# EAGLE design schemat1 (EAGLE 9.1.0)
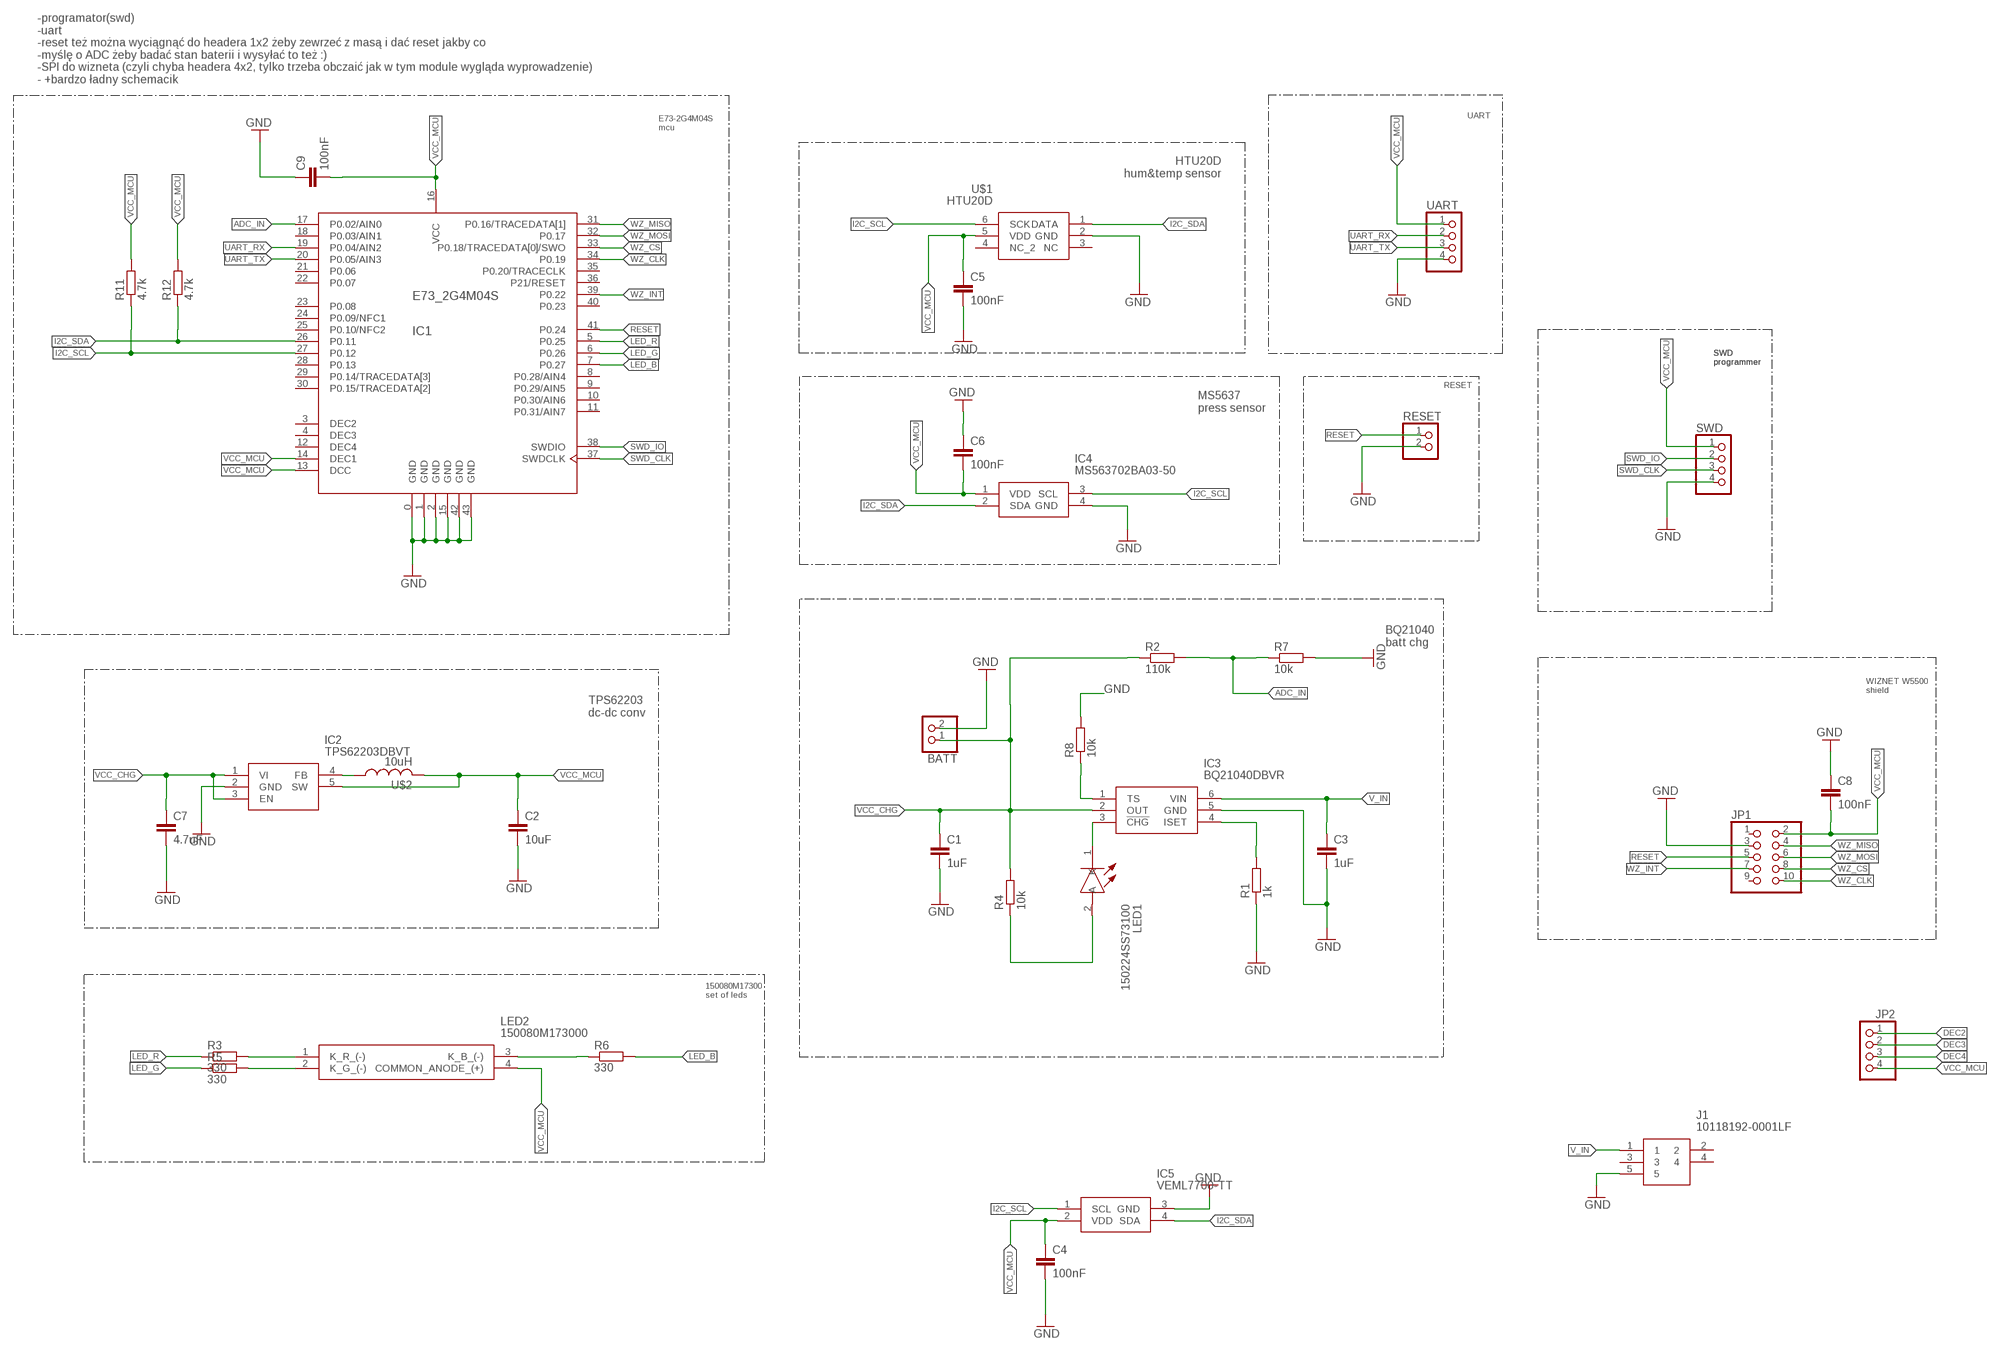
[diagram p0: schematic, sheet 1]

## Parts
BATT  PINHD-1X2  [1X02]
C1  1uF  C-EUC0603K  [C0603K]
C2  10uF  C-EUC0603K  [C0603K]
C3  1uF  C-EUC0603K  [C0603K]
C4  100nF  C-EUC0603K  [C0603K]
C5  100nF  C-EUC0603K  [C0603K]
C6  100nF  C-EUC0603K  [C0603K]
C7  4.7uF  C-EUC0603K  [C0603K]
C8  100nF  C-EUC0603K  [C0603K]
C9  100nF  C-EUC0603K  [C0603K]
IC1  E73_2G4M04S  [E73_2G4M04S]
IC2  TPS62203DBVT  [SOT95P280X145-5N]
IC3  BQ21040DBVR  [SOT95P280X145-6N]
IC4  MS563702BA03-50  [MS5637_1]
IC5  VEML7700-TT  [VEML7700]
J1  10118192-0001LF  [10118192-0001LF]
JP1  PINHD-2X5  [2X05]
JP2  PINHD-1X4  [1X04]
LED1  150224SS73100  [LEDM2314X131N]
LED2  150080M173000  [150080M173000]
R1  1k  R-EU_R0603  [R0603]
R2  110k  R-EU_R0603  [R0603]
R3  330  R-EU_R0603  [R0603]
R4  10k  R-EU_R0603  [R0603]
R5  330  R-EU_R0603  [R0603]
R6  330  R-EU_R0603  [R0603]
R7  10k  R-EU_R0603  [R0603]
R8  10k  R-EU_R0603  [R0603]
R11  4.7k  R-EU_R0603  [R0603]
R12  4.7k  R-EU_R0603  [R0603]
RESET  PINHD-1X2  [1X02]
SWD  PINHD-1X4  [1X04]
U$1  HTU20D  [SON100P300X300X113-7N]
U$2  10uH  LQG18DEV  [FB_BLM18PG121SN1D]
UART  PINHD-1X4  [1X04]

## Nets
ADC_IN: IC1.17(P0.02/AIN0) R2.2 R7.1
DEC2: JP2.1
DEC3: JP2.2
DEC4: JP2.3
GND: BATT.2 C1.2 C2.2 C3.2 C4.2 C5.2 C6.1 C7.2 C8.1 C9.1 IC1.0(GND) IC1.1(GND) IC1.2(GND) IC1.15(GND) IC1.42(GND) IC1.43(GND) IC2.2(GND) IC3.5(GND) IC4.4(GND) IC5.3(GND) J1.5 JP1.3 R1.1 R7.2 R8.2 RESET.2 SWD.4 U$1.2(GND) UART.4
I2C_SCL: IC1.27(P0.12) IC4.3(SCL) IC5.1(SCL) R11.1 U$1.6(SCK)
I2C_SDA: IC1.26(P0.11) IC4.2(SDA) IC5.4(SDA) R12.1 U$1.1(DATA)
LED_B: IC1.7(P0.27) R6.2
LED_G: IC1.6(P0.26) R5.1
LED_R: IC1.5(P0.25) R3.1
N$1: IC3.3(!CHG) LED1.1(K)
N$2: IC2.4(FB) U$2.1
N$3: LED1.2(A) R4.1
N$4: LED2.3(K_B_(-)) R6.1
N$5: IC3.4(ISET) R1.2
N$6: LED2.2(K_G_(-)) R5.2
N$7: LED2.1(K_R_(-)) R3.2
N$8: IC3.1(TS) R8.1
RESET: IC1.41(P0.24) JP1.5 RESET.1
SWD_CLK: IC1.37(SWDCLK) SWD.3
SWD_IO: IC1.38(SWDIO) SWD.2
UART_RX: IC1.19(P0.04/AIN2) UART.2
UART_TX: IC1.20(P0.05/AIN3) UART.3
V_IN: C3.1 IC3.6(VIN) J1.1
VCC_CHG: BATT.1 C1.1 C7.1 IC2.1(VI) IC2.3(EN) IC3.2(OUT) R2.1 R4.2
VCC_MCU: C2.1 C4.1 C5.1 C6.2 C8.2 C9.2 IC1.13(DCC) IC1.14(DEC1) IC1.16(VCC) IC2.5(SW) IC4.1(VDD) IC5.2(VDD) JP1.2 JP2.4 LED2.4(COMMON_ANODE_(+)) R11.2 R12.2 SWD.1 U$1.5(VDD) U$2.2 UART.1
WZ_CLK: IC1.34(P0.19) JP1.10
WZ_CS: IC1.33(P0.18/TRACEDATA[0]/SWO) JP1.8
WZ_INT: IC1.39(P0.22) JP1.7
WZ_MISO: IC1.31(P0.16/TRACEDATA[1]) JP1.4
WZ_MOSI: IC1.32(P0.17) JP1.6
Unconnected: IC1.8(P0.28/AIN4) IC1.9(P0.29/AIN5) IC1.10(P0.30/AIN6) IC1.11(P0.31/AIN7) IC1.18(P0.03/AIN1) IC1.21(P0.06) IC1.22(P0.07) IC1.23(P0.08) IC1.24(P0.09/NFC1) IC1.25(P0.10/NFC2) IC1.28(P0.13) IC1.29(P0.14/TRACEDATA[3]) IC1.30(P0.15/TRACEDATA[2]) IC1.35(P0.20/TRACECLK) IC1.36(P21/RESET) IC1.40(P0.23) J1.2 J1.3 J1.4 JP1.1 JP1.9 U$1.3(NC) U$1.4(NC_2)

## Notes on the sheet
- -programator(swd)
  -uart
  -reset też można wyciągnąć do headera 1x2 żeby zewrzeć z masą i dać reset jakby co
  -myślę o ADC żeby badać stan baterii i wysyłać to też :) 
  -SPI do wizneta (czyli chyba headera 4x2, tylko trzeba obczaić jak w tym module wygląda wyprowadzenie)
  - +bardzo ładny schemacik
- UART
- E73-2G4M04S
  mcu
- HTU20D
  hum&temp sensor
- SWD
  programmer
- SWD
  programmer
- RESET
- MS5637
  press sensor
- BQ21040
  batt chg
- WIZNET W5500
  shield
- TPS62203
  dc-dc conv
- 150080M17300
  set of leds

## Power pins joined to a net without a drawn wire
DEC2: IC1.3(DEC2)
DEC3: IC1.4(DEC3)
DEC4: IC1.12(DEC4)

## Library data of the parts
BATT RESET = pinhead:PINHD-1X2: PIN HEADER
C1-C9 = rcl:C-EU: CAPACITOR, European symbol; SPICEPREFIX: C
IC1 = E73-2G4M04S:E73_2G4M04S: E73-2G4M04S nRF52832 based BLE module
IC2 = TPS62203DBVT:TPS62203DBVT: 3.3-V Output, 300-mA, 95% Efficient Step-Down Converter in SOT-23 Source: Datasheet <http://www.ti.com/lit/gpn/tps62203>; DESCRIPTION: 3.3-V Output, 300-mA, 95% Efficient Step-Down Converter in SOT-23; HEIGHT: mm; MANUFACTURER_NAME: Texas Instruments; MANUFACTURER_PART_NUMBER: TPS62203DBVT; MOUSER_PART_NUMBER: 595-TPS62203DBVT; MOUSER_PRICE-STOCK: https://www.mouser.com/Search/Refine.aspx?Keyword=595-TPS62203DBVT; RS_PART_NUMBER: 6616976P; RS_PRICE-STOCK: http://uk.rs-online.com/web/p/products/6616976P
IC3 = BQ21040DBVR:BQ21040DBVR: 0.8A Single Input Single-Cell Li-Ion and Li-Pol Battery Charger Source: Datasheet <http://www.ti.com/lit/gpn/bq21040>; DESCRIPTION: 0.8A Single Input Single-Cell Li-Ion and Li-Pol Battery Charger; HEIGHT: 1.45mm; MANUFACTURER_NAME: Texas Instruments; MANUFACTURER_PART_NUMBER: BQ21040DBVR; MOUSER_PART_NUMBER: 595-BQ21040DBVR; MOUSER_PRICE-STOCK: https://www.mouser.com/Search/Refine.aspx?Keyword=595-BQ21040DBVR
IC4 = MS563702BA03-50:MS563702BA03-50: Sensor Pressure 2bar Barometric SMD MS563702BA03-50, Barometric Pressure Sensor, 1200mbar 0 ??? 3.6 V Output, 4-Pin QFN Source: Datasheet <http://docs-emea.rs-online.com/webdocs/142c/0900766b8142cddb.pdf>; DESCRIPTION: Sensor Pressure 2bar Barometric SMD MS563702BA03-50, Barometric Pressure Sensor, 1200mbar 0 ??? 3.6 V Output, 4-Pin QFN; HEIGHT: mm; MANUFACTURER_NAME: TE Connectivity; MANUFACTURER_PART_NUMBER: MS563702BA03-50; MOUSER_PART_NUMBER: 824-MS563702BA03-50; MOUSER_PRICE-STOCK: https://www.mouser.com/Search/Refine.aspx?Keyword=824-MS563702BA03-50; RS_PART_NUMBER: 1704370; RS_PRICE-STOCK: http://uk.rs-online.com/web/p/products/1704370
IC5 = VEML7700-TT:VEML7700-TT: 16Bit Ambient Light Sensor I2C 6.8x2.3mm Source: Datasheet <https://www.arrow.com/en/products/veml7700-tt/vishay>; DESCRIPTION: 16Bit Ambient Light Sensor I2C 6.8x2.3mm; HEIGHT: mm; MANUFACTURER_NAME: Vishay; MANUFACTURER_PART_NUMBER: VEML7700-TT; MOUSER_PART_NUMBER: 78-VEML7700-TT; MOUSER_PRICE-STOCK: https://www.mouser.com/Search/Refine.aspx?Keyword=78-VEML7700-TT; RS_PART_NUMBER: 1226791P; RS_PRICE-STOCK: http://uk.rs-online.com/web/p/products/1226791P
J1 = 10118192-0001LF:10118192-0001LF: FCI,10118192-0001LF,Connector,USB FCI Right Angle Surface Mount Mount Female USB Connector, 100 V ac, 1.8A Source: Datasheet <http://docs-emea.rs-online.com/webdocs/1450/0900766b814507ee.pdf>; ALLIED_NUMBER: 70236826; ALLIED_PRICE-STOCK: http://www.alliedelec.com/fci-10118192-0001lf/70236826/; DESCRIPTION: FCI,10118192-0001LF,Connector,USB FCI Right Angle Surface Mount Mount Female USB Connector, 100 V ac, 1.8A; HEIGHT: mm; MANUFACTURER_NAME: FCI; MANUFACTURER_PART_NUMBER: 10118192-0001LF; MOUSER_PART_NUMBER: 649-10118192-0001LF; MOUSER_PRICE-STOCK: https://www.mouser.com/Search/Refine.aspx?Keyword=649-10118192-0001LF; RS_PART_NUMBER: 8632986; RS_PRICE-STOCK: http://uk.rs-online.com/web/p/products/8632986
JP1 = pinhead:PINHD-2X5: PIN HEADER
JP2 SWD UART = pinhead:PINHD-1X4: PIN HEADER
LED1 = 150224SS73100:150224SS73100: WURTH ELEKTRONIK - 150224SS73100 - LED, RED, 130MCD, 636NM, 2214 Source: Datasheet <http://www.farnell.com/datasheets/2301711.pdf>; DESCRIPTION: WURTH ELEKTRONIK - 150224SS73100 - LED, RED, 130MCD, 636NM, 2214; HEIGHT: 1.31mm; MANUFACTURER_NAME: Wurth Elektronik; MANUFACTURER_PART_NUMBER: 150224SS73100; MOUSER_PART_NUMBER: 710-150224SS73100; MOUSER_PRICE-STOCK: https://www.mouser.com/Search/Refine.aspx?Keyword=710-150224SS73100; RS_PART_NUMBER: 1766090; RS_PRICE-STOCK: http://uk.rs-online.com/web/p/products/1766090
LED2 = 150080M173000:150080M173000: Wurth Elektronik 150080M173000, WL-SFCW 470 (Blue) nm, 525 (Green) nm, 624 (Red) nm 3 RGB LED, 4-Pin 0805 Clear Source: Datasheet <http://uk.rs-online.com/web/p/products/1766236>; DESCRIPTION: Wurth Elektronik 150080M173000, WL-SFCW 470 (Blue) nm, 525 (Green) nm, 624 (Red) nm 3 RGB LED, 4-Pin 0805 Clear; HEIGHT: 0.5mm; MANUFACTURER_NAME: Wurth Elektronik; MANUFACTURER_PART_NUMBER: 150080M173000; MOUSER_PART_NUMBER: 710-150080M173000; MOUSER_PRICE-STOCK: https://www.mouser.com/Search/Refine.aspx?Keyword=710-150080M173000; RS_PART_NUMBER: 1766236; RS_PRICE-STOCK: http://uk.rs-online.com/web/p/products/1766236
R1-R8 R11 R12 = rcl:R-EU_: RESISTOR, European symbol; SPICEPREFIX: R
U$1 = SON100P300X300X113-7N:HTU20D
U$2 = LQG18HN12NJ00D:LQG18DEV

## Board
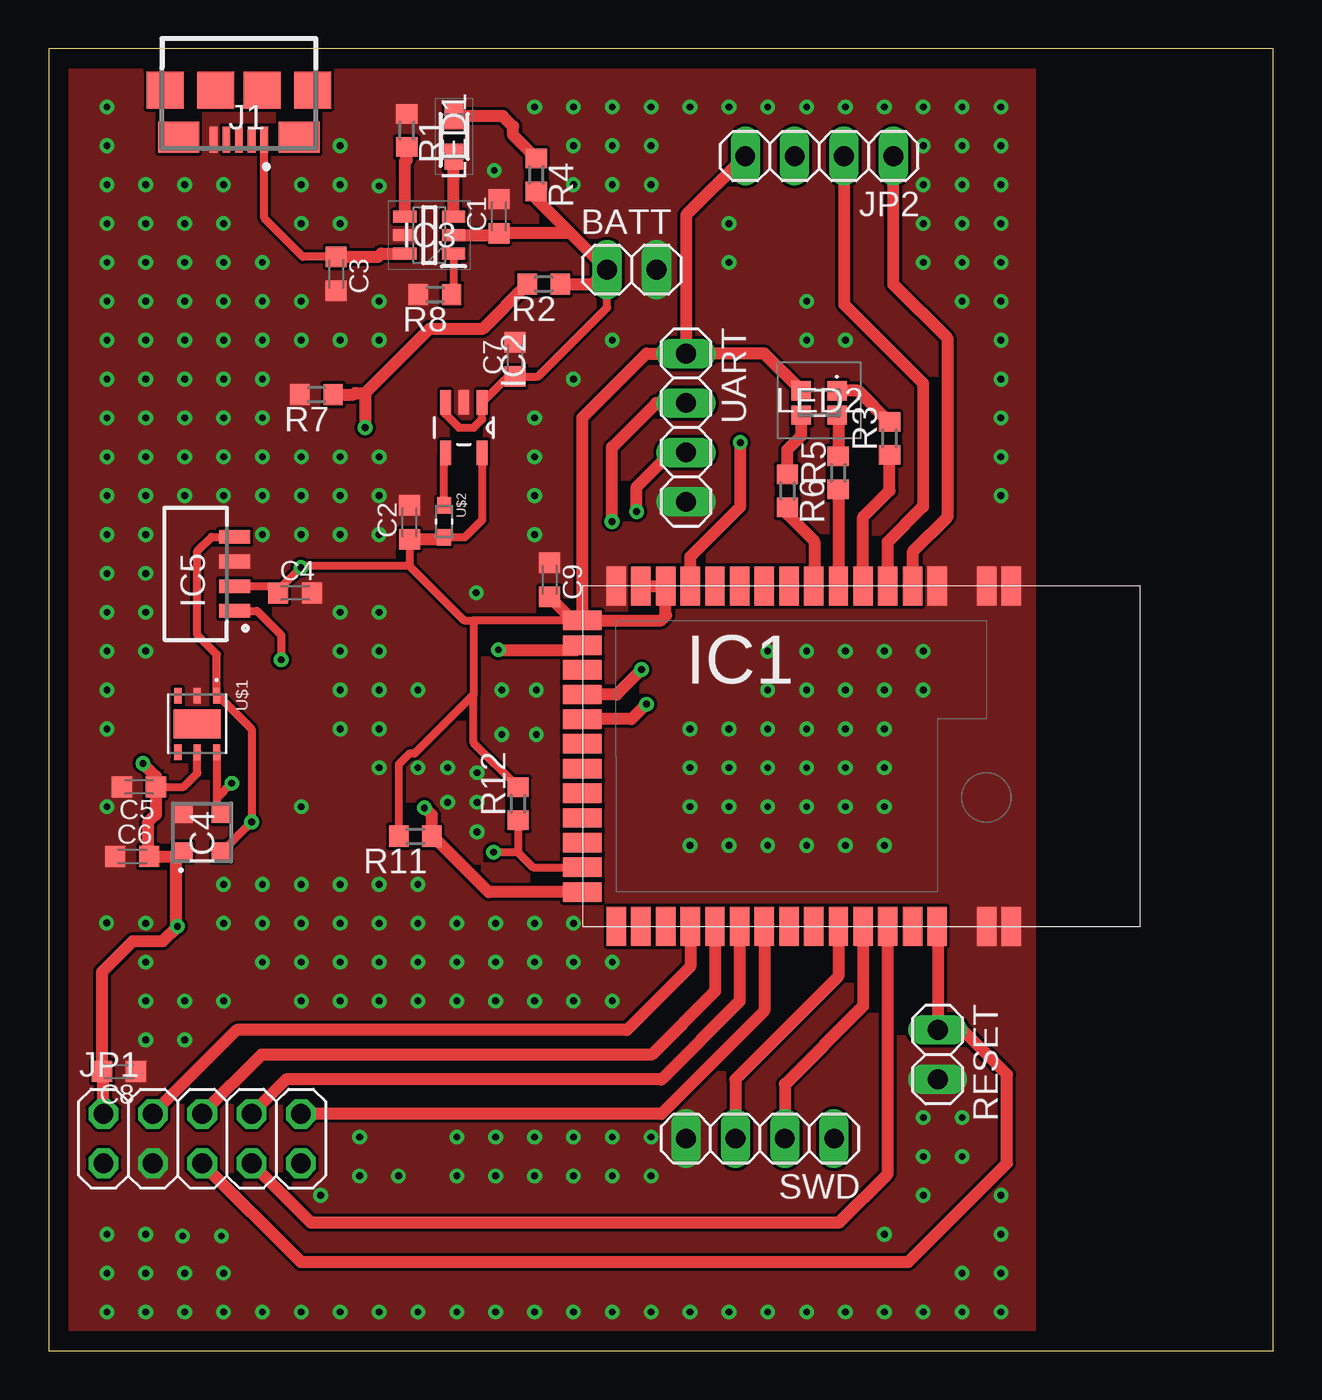
[diagram p1: board, top side]
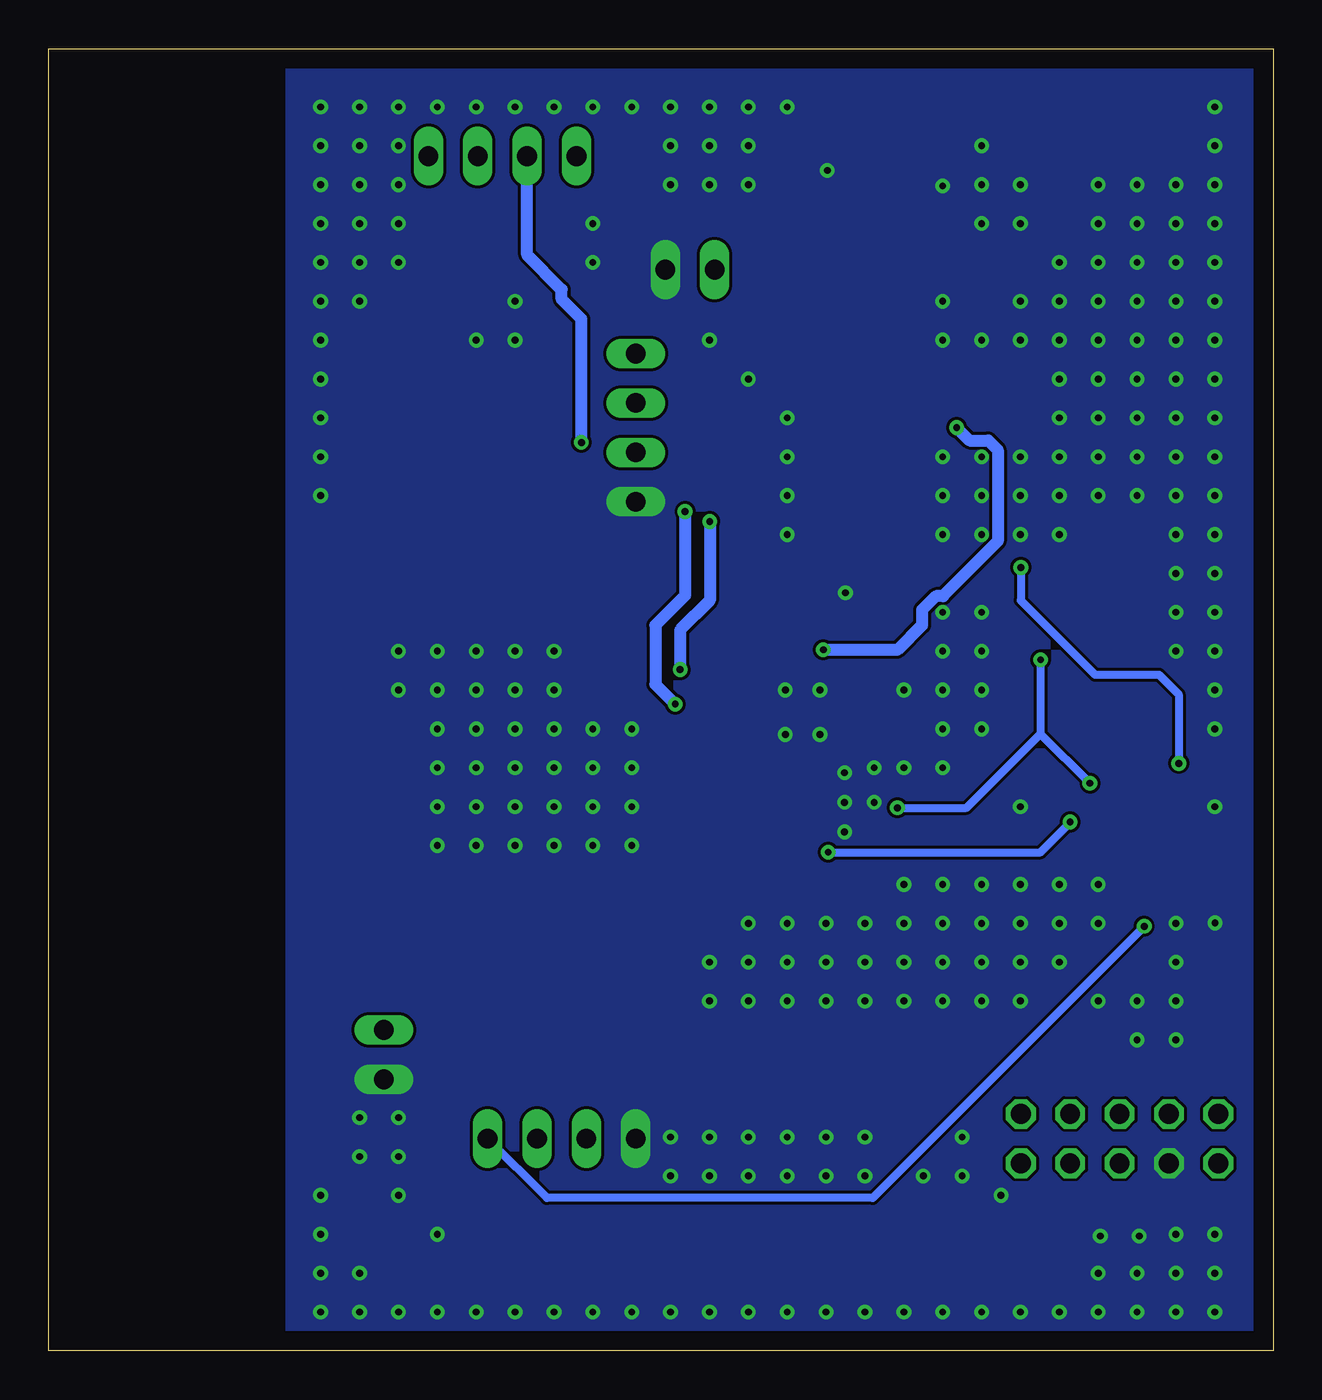
[diagram p2: board, bottom side, seen from below]

Size 63 x 67 mm. Coordinates in mm from the lower left corner, seen from the top.
Outline: 0,0 63,0 63,67 0,67 0,0
Copper layers (1*16): Top 0.035mm / dielectric 1.5mm / Bottom 0.035mm
Design rules "default": minimum track width 6mil, minimum drill 0.35mm, track to track 6mil, track to pad 6mil, pad to pad 6mil, via to via 6mil, smd to smd 6mil, copper to edge 40mil, drill to drill 6mil, minimum pad ring 10mil, minimum via ring 8mil, stop-mask expansion 4mil, vias tented up to drill 0mil, thermal gap 10mil

### Footprints (pad centres in the part's own frame; a part is rotated, then mirrored left to right if it is on the bottom)
1X02 = drill 1.016 long: 1 -1.27,0; 2 1.27,0
C0603K = smd 1.05 x 1.08: 1 -0.875,0; 2 0.875,0
E73_2G4M04S = smd 1 x 2: 0 22.065,17.5; 1 20.795,17.5; 2 18.255,17.5; 3 16.985,17.5; 4 15.715,17.5; 5 14.445,17.5; 6 13.175,17.5; 7 11.905,17.5; 8 10.635,17.5; 9 9.365,17.5; 10 8.095,17.5; 11 6.825,17.5; 12 5.555,17.5; 13 4.285,17.5; 14 3.015,17.5; 15 1.745,17.5; 28 1.745,0; 29 3.015,0; 30 4.285,0; 31 5.555,0; 32 6.825,0; 33 8.095,0; 34 9.365,0; 35 10.635,0; 36 11.905,0; 37 13.175,0; 38 14.445,0; 39 15.715,0; 40 16.985,0; 41 18.255,0; 42 20.795,0; 43 22.065,0 | smd 2 x 1: 16 0,15.735; 17 0,14.465; 18 0,13.195; 19 0,11.925; 20 0,10.655; 21 0,9.385; 22 0,8.115; 23 0,6.845; 24 0,5.575; 25 0,4.305; 26 0,3.035; 27 0,1.765
SOT95P280X145-5N = smd 1.27 x 0.559: 1 -1.295,0.94; 2 -1.295,0; 3 -1.295,-0.94; 4 1.295,-0.94; 5 1.295,0.94
SOT95P280X145-6N = smd 1.2 x 0.6: 1 -1.25,0.95; 2 -1.25,0; 3 -1.25,-0.95; 4 1.25,-0.95; 5 1.25,0; 6 1.25,0.95
MS5637_1 = smd 1 x 1: 1 -1,1; 2 -1,-1; 3 1,-1; 4 1,1
VEML7700 = smd 0.7 x 1.6: 1 1.495,-0.4; 2 2.765,-0.4; 3 4.035,-0.4; 4 5.305,-0.4
10118192-0001LF = smd 0.4 x 1.35: 1 2.65,5.22; 2 3.3,5.22; 3 3.95,5.22; 4 4.6,5.22; 5 5.25,5.22 | smd 2.1 x 1.6: 6 0.85,5.095; 7 7.05,5.095 | smd 1.9 x 1.9: 8 2.75,2.67; 9 5.15,2.67; 10 0.15,2.67; 11 7.75,2.67
2X05 = drill 1.016 octagon: 1 -5.08,-1.27; 2 -5.08,1.27; 3 -2.54,-1.27; 4 -2.54,1.27; 5 0,-1.27; 6 0,1.27; 7 2.54,-1.27; 8 2.54,1.27; 9 5.08,-1.27; 10 5.08,1.27
1X04 = drill 1.016 long: 1 -3.81,0; 2 -1.27,0; 3 1.27,0; 4 3.81,0
LEDM2314X131N = smd 1.35 x 0.95: 1 -1.05,0; 2 1.05,0
150080M173000 = smd 1 x 1: 1 0.925,0.625; 2 0.925,-0.625; 3 -0.925,-0.625; 4 -0.925,0.625
R0603 = smd 1 x 1.1: 1 -0.85,0; 2 0.85,0
SON100P300X300X113-7N = smd 0.8 x 0.42: 1 -1.455,1; 2 -1.455,0; 3 -1.455,-1; 4 1.455,-1; 5 1.455,0; 6 1.455,1 | smd 1.5 x 2.4: 7 0,0
FB_BLM18PG121SN1D = smd 0.85 x 0.7: 1 -0.825,0; 2 0.825,0

### Placement (x,y rotation side)
BATT  30,55.63 0 top
C1  23.17,58.38 90 top
C2  18.57,42.63 90 top
C3  14.8,55.42 270 top
C4  12.68,38.99 0 top
C5  4.64,29.02 180 top
C6  4.3,25.44 0 top
C7  24,51.01 90 top
C8  3.63,14.38 180 top
C9  25.78,39.67 270 top
IC1  27.46,21.84 0 top
IC2  21.36,47.5 270 top
IC3  19.59,57.4 180 top
IC4  7.9,26.67 90 top
IC5  9.17,36.58 90 top
J1  13.74,67.53 180 top
JP1  7.9,10.92 0 top
JP2  39.65,61.47 180 top
LED1  20.86,62.48 90 top
LED2  39.65,48.77 0 top
R1  18.43,62.78 270 top
R2  25.47,54.88 180 top
R3  43.26,46.95 90 top
R4  25.09,60.5 270 top
R5  40.63,45.17 90 top
R6  38.01,44.24 270 top
R7  13.79,49.2 180 top
R8  19.88,54.34 180 top
R11  18.87,26.47 180 top
R12  24.15,28.15 90 top
RESET  45.75,15.24 270 top
SWD  36.6,10.92 180 top
U$1  7.65,32.26 270 top
U$2  20.35,42.67 270 top
UART  32.79,47.5 270 top

### Tracks (layer width: path | path; a pad name or v marks a point on that pad's centre or on a via)
ADC_IN  (via drill 0.35)
  Top 0.61: v23.14,36.07 27.22,36.07 IC1.17 | R2.2 22.32,52.58 19.59,52.58 16.28,49.28 | 16.28,49.28 15.78,49.28 15.7,49.2 R7.1 | 16.28,49.28 v16.28,47.5
  Bottom 0.61: v23.14,36.07 19.33,36.07 18.06,37.34 18.06,38.12 17.35,38.84 16.98,38.84 14.17,41.65 14.17,46.35 14.65,46.84 15.62,46.84 v16.28,47.5
DEC2
  Top 0.61: IC1.3 44.48,39.38 44.48,41.15 46.26,42.93 46.26,52.07 43.46,54.86 JP2.1
DEC3
  Top 0.61: IC1.4 43.18,41.62 44.99,43.43 44.99,49.78 40.92,53.85 JP2.2
DEC4  (via drill 0.35)
  Top 0.61: IC1.12 33.01,40.86 35.59,43.43 v35.59,46.74
  Bottom 0.61: v35.59,46.74 35.59,53.09 36.6,54.1 36.6,54.61 38.38,56.39 JP2.3
GND  (via drill 0.35)
  other vias: 22,39 17,42 15,42 13,42 11,42 11,44 13,44 15,44 17,44 17,46 15,46 13,46 11,46 11,48 17,52 17,54 11,50 15,52 13,54 13,52 11,52 11,54 9,52 9,50 9,48 9,46 9,44 7,44 7,46 7,48 7,50 7,52 7,54 9,54 5,54 3,54 3,52 5,52 5,50 3,50 3,48 5,48 5,46 3,46 3,44 5,44 3,42 5,42 5,40 3,40 3,38 5,38 3,36 5,36 3,34 3,32 3,28 2.98,22.02 5,22 5,20 5,18 7,18 7,16 5,16 9,18 9,22 9,24 5,6 3,6 5,4 3,4 9,58 9,56 7,56 7,58 7,60 9,60 5,60 3,60 3,58 5,58 5,56 3,56 3,62 3,64 11,56 13,60 15,60 15,58 13,58 15,62 17,59.94 25,64 27,64 29,64 31,64 33,64 35,64 37,64 39,64 41,64 43,64 31,60 27,60 29,60 29,62 27,62 31,62 29,52 27,50 25,48 25,46 25,44 25,42 17,32 15,32 15,34 17,34 19,34 17,36 15,36 15,38 17,38 17,30 19,30 19,20 19,22 19,24 17,22 17,20 15,20 15,22 15,24 17,24 13,24 11,24 11,22 13,22 13,20 11,20 19,18 17,18 15,18 13,18 21,22 23,22 25,22 27,22 27,20 29,20 29,18 27,18 25,20 23,20 21,20 25,18 23,18 21,18 13,28 35,58 35,56 39,54 39,52 41,52 45,64 47,64 49,64 45,62 47,62 49,62 49,58 45,58 47,58 47,60 45,60 49,60 49,54 47,54 47,56 49,56 45,56 49,52 49,50 49,48 49,46 49,44 43,26 41,26 41,28 43,28 41,30 43,30 43,32 41,32 39,32 39,30 39,28 39,26 37,26 37,28 37,30 37,32 33,32 35,32 35,30 33,30 33,28 35,28 35,26 33,26 43,34 45,34 45,36 43,36 41,36 41,34 39,34 39,36 37,36 37,34 20.52,30 22.05,29.75 22.05,28.22 22.05,26.7 20.52,28.22 23.32,34 25.1,34 25.1,31.71 23.32,31.71 22.94,60.73 6.89,5.9 8.89,5.9 7,4 9,4 9,2 7,2 5,2 3,2 11,2 13,2 15,2 17,2 19,2 21,2 23,2 25,2 27,2 29,2 31,2 33,2 35,2 37,2 39,2 41,2 43,2 45,2 47,2 49,2 49,4 49,6 49,8 47,4 47,10 47,12 45,12 45,10 45,8 43,6 29,11 31,11 31,9 29,9 27,11 25,11 27,9 25,9 23,11 23,9 21,9 21,11 16,11 16,9 18,9 14,8
  pour Top (no thermals): -1,68 -1,-2 50.5,-2 50.5,70.5 -0.5,70.5 -1,70
  pour Bottom (no thermals): -1.5,70.5 -1.5,-2 50,-2 50.5,-2.5 50.5,75 -1.5,75 -2,74.5 -2,71
I2C_SCL  (via drill 0.35)
  Top 0.406: U$1.6 8.65,28.45 | 8.65,28.45 8.65,27.92 IC4.3 | IC5.1 10.72,38.07 11.97,36.83 v11.97,35.56 | v9.43,29.21 8.66,28.45 8.65,28.45 | 19.34,27.95 v19.33,27.94
  Top 0.61: IC1.27 22.65,23.61 19.78,26.47 R11.1 19.72,27.58 19.34,27.95
  Bottom 0.406: v11.97,35.56 11.97,31.75 | 11.97,31.75 v9.43,29.21 | v19.33,27.94 15.78,27.94 11.97,31.75
I2C_SDA  (via drill 0.35)
  Top 0.406: IC5.4 8.38,41.88 7.65,41.15 7.65,36.83 8.65,35.83 U$1.1 8.73,33.71 10.44,32 v10.44,27.21 IC4.2 | 24.16,25.65 v22.89,25.65 | R12.1 24.15,25.66 24.16,25.65 | 24.16,25.65 24.93,24.88 IC1.26
  Bottom 0.406: v22.89,25.65 11.97,25.65 10.44,27.18 v10.44,27.21
LED_B
  Top 0.61: IC1.7 39.4,39.38 39.4,41.66 38.01,43.04 R6.2
LED_G
  Top 0.61: IC1.6 40.67,39.38 40.63,39.42 R5.1
LED_R
  Top 0.61: R3.1 43.26,44.25 41.91,42.89 IC1.5
N$1
  Top 0.61: IC3.3 20.84,61.41 LED1.1
N$2
  Top 0.406: U$2.1 20.35,46.13 IC2.4
N$3
  Top 0.61: R4.1 23.9,62.53 23.9,62.99 23.36,63.53 LED1.2
N$4
  Top 0.61: R6.1 38.01,46.37 38.73,47.08 LED2.3
N$5
  Top 0.61: IC3.4 18.34,61.18 18.43,61.27 R1.2
N$6
  Top 0.61: LED2.2 40.63,48.09 R5.2
N$7
  Top 0.61: R3.2 41.66,49.39 LED2.1
N$8
  Top 0.406: IC3.1 20.84,54.44 R8.1
RESET
  Top 0.61: IC1.41 45.75,21.81 RESET.1 47.02,16.51 49.3,14.22 49.3,9.65 44.22,4.57 12.98,4.57 JP1.5
SWD_CLK
  Top 0.61: IC1.37 40.63,19.27 35.33,13.97 SWD.3
SWD_IO
  Top 0.61: IC1.38 41.91,17.75 37.87,13.72 SWD.2
UART_RX  (via drill 0.35)
  Top 0.61: UART.2 31.27,48.77 28.98,46.48 v28.98,42.67 | v30.51,35.05 29.22,33.77 IC1.19
  Bottom 0.61: v28.98,42.67 28.98,38.61 30.51,37.08 v30.51,35.05
UART_TX  (via drill 0.35)
  Top 0.61: v30.25,43.18 30.25,44.45 32.03,46.23 UART.3 | v30.76,33.27 29.99,32.5 IC1.20
  Bottom 0.61: v30.25,43.18 30.25,38.86 31.78,37.34 31.78,34.29 v30.76,33.27
V_IN
  Top 0.406: J1.1 11.09,58.28 13.08,56.29 C3.1
  Top 0.61: C3.1 16.95,56.29 17.11,56.45 IC3.6
VCC_CHG
  Top 0.406: IC2.3 20.42,48.18 21.11,47.5 21.87,47.5 22.3,47.93 IC2.1 23.64,50.13 C7.1 25.19,50.13 28.73,53.67 BATT.1
  Top 0.61: IC3.2 23.07,57.4 C1.1 26.86,57.5 | 26.86,57.5 BATT.1 27.99,54.88 R2.1 | R4.2 25.09,59.26 26.86,57.5
VCC_MCU  (via drill 0.35)
  Top 0.406: IC1.16 25.17,37.58 23.9,37.58 21.87,37.58 | 21.87,37.58 21.38,37.58 18.57,40.39 | IC2.5 22.3,42.75 21.4,41.85 U$2.2 | 21.87,37.58 21.87,33.78 | 6.55,21.93 v6.63,21.84 | 21.87,33.78 18.82,30.73 18.57,30.73 18.02,30.18 R11.2 | R12.2 21.87,31.28 21.87,33.78 | C2.1 18.57,40.39 | 18.57,40.39 13.06,40.39 | 13.06,40.39 v12.98,40.3 | IC5.2 11.46,39.34 C4.1 11.81,39.13 13.06,40.39 | C5.1 6.95,29.02 7.65,29.72 U$1.5
  Top 0.61: IC1.16 27.46,48.01 30.76,51.31 UART.1 | LED2.4 36.81,51.31 UART.1 | JP2.4 32.79,58.42 UART.1 | IC1.16 31.51,37.58 31.78,37.85 31.75,37.88 IC1.13 IC1.14 | C9.2 26.99,37.58 IC1.16 | U$2.2 20.25,41.75 C2.1 | JP1.2 2.82,14.31 C8.2 2.75,19.49 4.35,21.08 5.87,21.08 v6.63,21.84 | 6.55,21.93 6.55,25.32 IC4.1 6.67,25.44 C6.2 5.11,25.5 5.11,27.18 5.52,27.59 C5.1 5.52,29.56 v4.85,30.23
  Bottom 0.406: v12.98,40.3 12.98,38.61 9.17,34.8 5.87,34.8 4.85,33.78 v4.85,30.23 | v6.63,21.84 20.6,7.87 37.37,7.87 SWD.1
WZ_CLK
  Top 0.61: IC1.34 36.82,17.49 31.52,12.19 JP1.10
WZ_CS
  Top 0.61: IC1.33 35.56,18 31.52,13.97 12.22,13.97 JP1.8
WZ_INT
  Top 0.61: IC1.39 43.18,9.11 40.67,6.6 13.49,6.6 JP1.7
WZ_MISO
  Top 0.61: IC1.31 33.01,19.78 29.75,16.51 9.68,16.51 JP1.4
WZ_MOSI
  Top 0.61: IC1.32 34.28,18.51 31.02,15.24 10.95,15.24 JP1.6